# EAGLE design isolated_powerSerial_v2 (EAGLE 6.4)
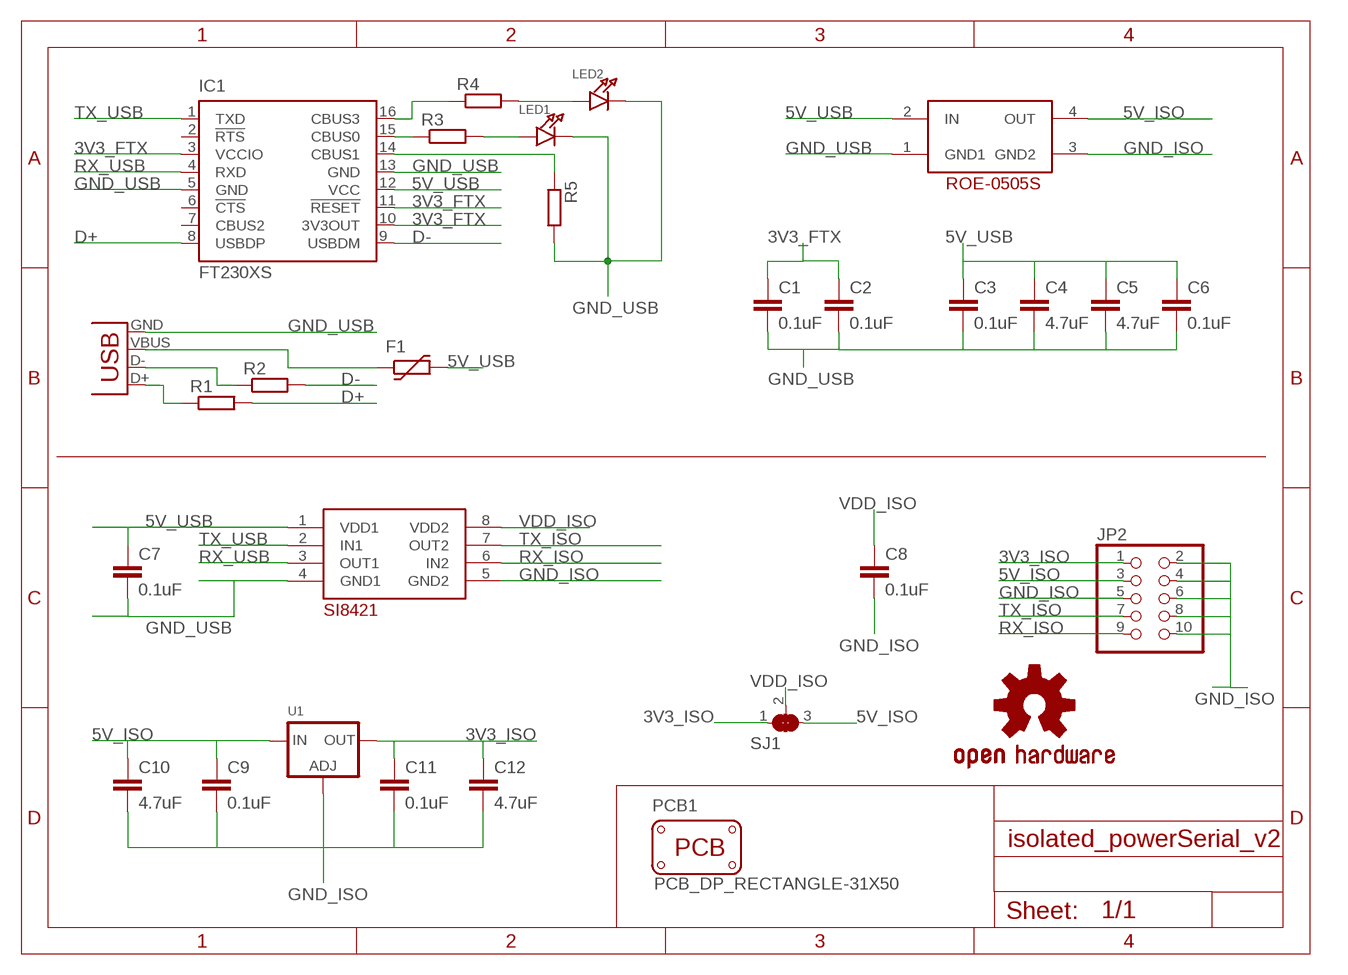
[diagram p0: schematic, sheet 1]

## Parts
C1  0.1uF  C-EUC0603  [C0603]
C2  0.1uF  C-EUC0603  [C0603]
C3  0.1uF  C-EUC0603  [C0603]
C4  4.7uF  C-EUC0603  [C0603]
C5  4.7uF  C-EUC0603  [C0603]
C6  0.1uF  C-EUC0603  [C0603]
C7  0.1uF  C-EUC0603  [C0603]
C8  0.1uF  C-EUC0603  [C0603]
C9  0.1uF  C-EUC0603  [C0603]
C10  4.7uF  C-EUC0603  [C0603]
C11  0.1uF  C-EUC0603  [C0603]
C12  4.7uF  C-EUC0603  [C0603]
F1  FUSE_PTC-0805  [PTC0805]
IC1  FT230XS  [SSOP16]
JP1  USB-SMD-NS  [USB-MINIB-NOSTOP]
JP2  PINHD-2X5  [2X05]
LED1  LED0805  [CHIPLED_0805]
LED2  LED0805  [CHIPLED_0805]
LOGO1  OSHW-LOGOS  [OSHW-LOGO-S]
PCB1  PCB_DP_RECTANGLE-31X50  [DP5031_V1]
R1  R-EU_R0603  [R0603]
R2  R-EU_R0603  [R0603]
R3  R-EU_R0603  [R0603]
R4  R-EU_R0603  [R0603]
R5  R-EU_R0603  [R0603]
SJ1  SOLDERJUMPER_2WAY0603  [SOLDERJUMPER_2WAY_OPEN_0603]
U1  LM1117SOT223-REFLOW  [SOT223-R]
U$1  IHSAN_RECOM_ROE-0505S  [IHSAN_ROE]
U$2  IHSAN_SI8421  [SO08]

## Nets
3V3_FTX: C1.1 C2.1 IC1.3(VCCIO) IC1.10(3V3OUT) IC1.11(!RESET)
3V3_ISO: C11.1 C12.1 JP2.1 SJ1.1 U1.2(OUT)
5V_ISO: C9.1 C10.1 JP2.3 SJ1.3 U1.3(IN) U$1.4(OUT)
5V_USB: C3.1 C4.1 C5.1 C6.1 C7.1 F1.2 IC1.12(VCC) U$1.2(IN) U$2.1(VDD1)
D+: IC1.8(USBDP) R1.2
D-: IC1.9(USBDM) R2.2
GND_ISO: C8.2 C9.2 C10.2 C11.2 C12.2 JP2.2 JP2.4 JP2.5 JP2.6 JP2.8 JP2.10 U1.1(ADJ) U$1.3(GND2) U$2.5(GND2)
GND_USB: C1.2 C2.2 C3.2 C4.2 C5.2 C6.2 C7.2 IC1.5(GND) IC1.13(GND) JP1.GND LED1.C LED2.C R5.2 U$1.1(GND1) U$2.4(GND1)
N$1: JP1.D- R2.1
N$2: JP1.D+ R1.1
N$3: LED1.A R3.2
N$4: LED2.A R4.2
N$5: F1.1 JP1.VBUS
N$11: IC1.14(CBUS1) R5.1
N$12: IC1.15(CBUS0) R3.1
N$13: IC1.16(CBUS3) R4.1
RX_ISO: JP2.9 U$2.6(IN2)
RX_USB: IC1.4(RXD) U$2.3(OUT1)
TX_ISO: JP2.7 U$2.7(OUT2)
TX_USB: IC1.1(TXD) U$2.2(IN1)
VDD_ISO: C8.1 SJ1.2 U$2.8(VDD2)
Unconnected: IC1.2(!RTS) IC1.6(!CTS) IC1.7(CBUS2)

## Library data of the parts
C1-C12 = rcl:C-EU: CAPACITOR, European symbol
F1 = dp_devices:FUSE_PTC: Resettable PTC
IC1 = ftdichip:FT230X: USB to BASIC UART IC Auto generated by make-symbol-device-package-bsdl.ulp Rev. 43 Source: Data sheet <http://www.ftdichip.com/Support/Documents/DataSheets/ICs/DS_FT230X.pdf>
JP1 = SparkFun-Connectors:USB: USB Connectors USB-B-PTH is fully proven SKU : PRT-00139/CONN-08278 USB-miniB is fully proven SKU : PRT-00587 USB-A-PCB is untested. USB-A-H is throughly reviewed, but untested. Spark Fun Electronics SKU : PRT-00437 USB-B-SMT is throughly reviewed, but untested. Needs silkscreen touching up. USB-A-S has not been used/tested USB-MB-H has not been used/tested USB-MICROB has been used. CONN-09505
JP2 = pinhead:PINHD-2X5: PIN HEADER
LED1 LED2 = microbuilder:LED: LED 0603 - 0603 Surface Mount Package 2mA: Green LED - Low Power (3.9mcd, 2ma, 1.7Vf) - Digikey: 475-2709-2-ND Orange LED - Low Power (9.8mcd, 2ma, 1.8Vf) - Digikey: 475-1194-2-ND Red LED - Low Power (5mcd, 2ma, 1.8Vf) - Digikey: 475-1195-2-ND Yellow LED - Low Power (7mcd, 2ma, 1.8Vf) - Digikey: 475-1196-2-ND 5mA: Blue LED - Low Power (17mcd, 5ma, 2.9Vf) - Digikey: LNJ937W8CRACT-ND 0805 - 0805 Surface Mount Package 2mA: Red LED (8.8mcd, 2mA, 1.8Vf, Clear) - Low Power [Digikey: 475-2510-1-ND] Green LED (5mcd, 2mA, 1.8Vf, Clear) - Low Power [Digikey: 475-2730-1-ND] Yellow LED (11.3mcd, 2mA, 1.8Vf, Clear) - Low Power [Digikey: 475-2555-1-ND] 20mA: Red LED (104mcd, 20mA, Diffused) - LS R976 [Digikey: 475-1278-6-ND] Red LED (12mcd, 20mA, 2.0Vf, Clear) - APT2012EC [Digikey: 754-1128-1-ND] Green LED (15mcd, 20mA, 2.2Vf, Clear) - APT2012GC [Digikey: 754-1131-1-ND] Orange LED (160mcd, 20mA, 2.1Vf, Clear) - APT2012SECK [Digikey: 754-1130-1-ND] 1206 - 1206 Surface Mount Package Green LED (26mcd, 20mA, Diffused) - LG N971 [Digikey: 475-1407-6-ND] Red LED (15mcd, 20mA, Diffused) - LH N974 [Digikey: 475-1416-6-ND]
LOGO1 = SparkFun-Aesthetics:OSHW-LOGO: Open Source Hardware Logo This logo indicates the piece of hardware it is found on incorporates a OSHW license and/or adheres to the definition of open source hardware found here: http://freedomdefined.org/OSHW
PCB1 = dp_devices:PCB_DP_RECTANGLE: Dangerous Prototypes Standard Rectangular PCB sizes
R1-R5 = rcl:R-EU_: RESISTOR, European symbol
SJ1 = microbuilder:SOLDERJUMPER_2WAY: 2-Way Solder Jumper
U1 = microbuilder:LM1117: LM1117 Voltage Regulator LM1117 Adjustable Voltage regulator [Digikey: LM1117IMP-ADJDKR-ND] LM1117 3.3V Voltage regulator [AP1117E33GDIDKR-ND] LM1117 5.0V Voltage regulator [AP1117E50GDIDKR-ND] SOT223-REFLOW - SOT223 package for solder paste/reflow ovens SOT223-WAVE - SOT223 package for hand-soldering (larger pads) Note: For the fixed-voltage regulators, simply set the ADJ pin to GND.
U$1 = SparkFun-DigitalIC_ihsan:IHSAN_RECOM_ROE-0505S
U$2 = SparkFun-DigitalIC_ihsan:IHSAN_SI8421

## Board
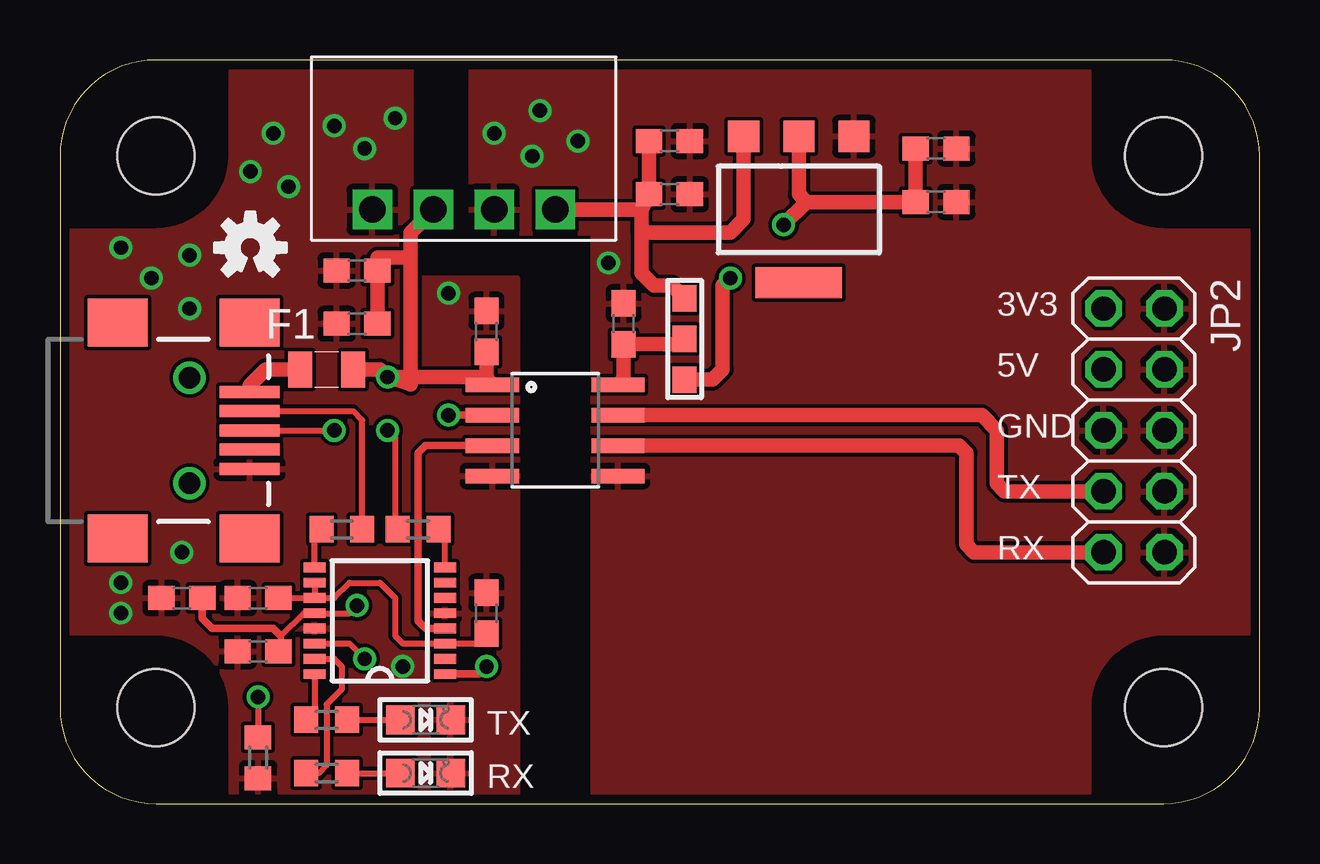
[diagram p1: board, top side]
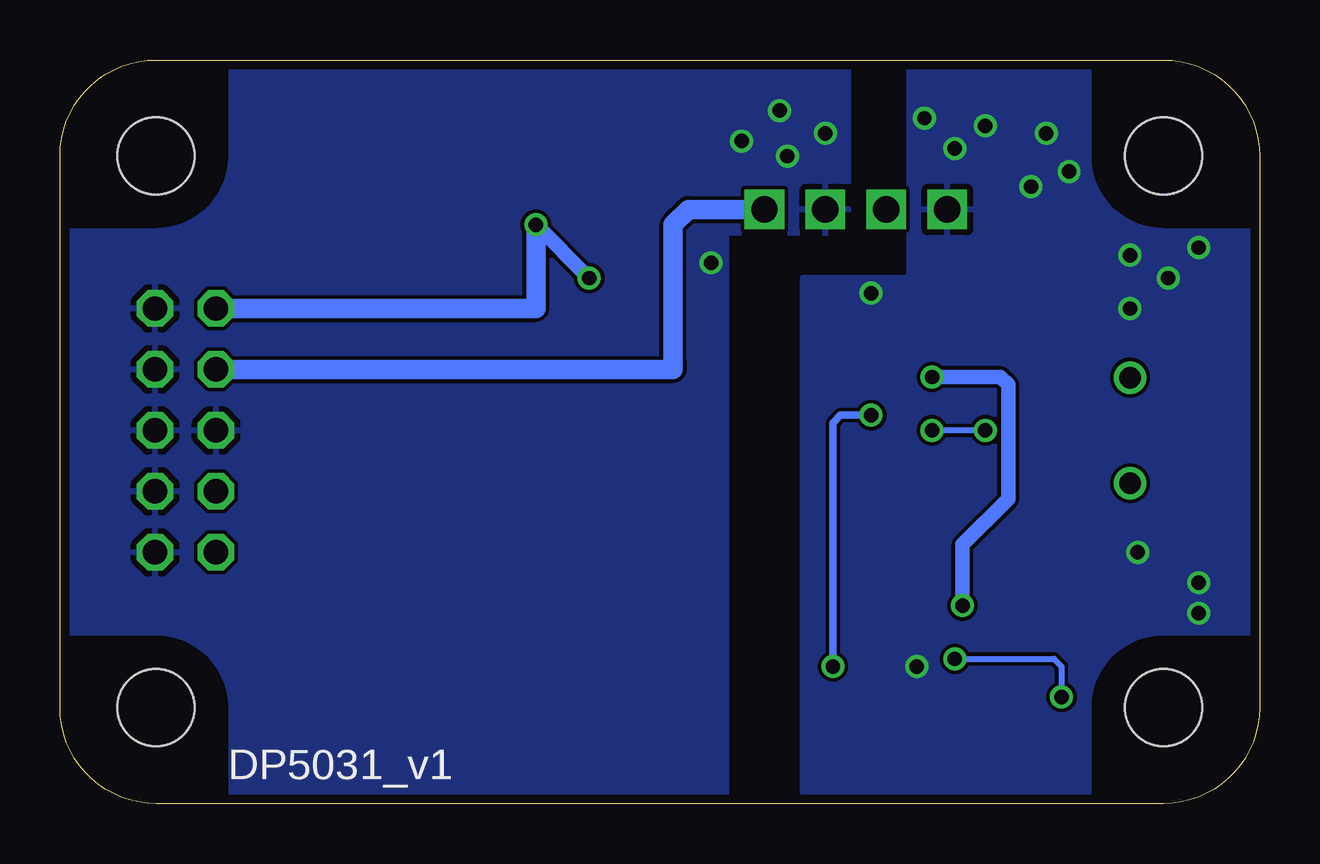
[diagram p2: board, bottom side, seen from below]

Size 50 x 31 mm. Coordinates in mm from the lower left corner, seen from the top.
Copper layers (1*16): Top 0.0356mm / dielectric 1.5011mm / Bottom 0.0356mm
Design rules "LaenPCBOrder": minimum track width 6mil, minimum drill 13mil, track to track 6mil, track to pad 6mil, pad to pad 6mil, via to via 6mil, smd to smd 6mil, copper to edge 15mil, drill to drill 6mil, minimum pad ring 7mil, minimum via ring 7mil, stop-mask expansion 4mil, vias tented up to drill 0mil, thermal gap 10mil

### Footprints (pad centres in the part's own frame; a part is rotated, then mirrored left to right if it is on the bottom)
C0603 = smd 1.1 x 1: 1 -0.85,0; 2 0.85,0
PTC0805 = smd 1 x 1.5: 1 -1.1,0; 2 1.1,0
SSOP16 = smd 0.914 x 0.406: 1 -2.718,2.223; 2 -2.718,1.587; 3 -2.718,0.953; 4 -2.718,0.318; 5 -2.718,-0.318; 6 -2.718,-0.953; 7 -2.718,-1.587; 8 -2.718,-2.223; 9 2.718,-2.223; 10 2.718,-1.587; 11 2.718,-0.953; 12 2.718,-0.318; 13 2.718,0.318; 14 2.718,0.953; 15 2.718,1.587; 16 2.718,2.223
USB-MINIB-NOSTOP = smd 2.5 x 0.5: D+ 2.5,0; D- 2.5,0.8; GND 2.5,-1.6; ID 2.5,-0.8; VBUS 2.5,1.6 | smd 2.5 x 2: G1 -3,-4.5; G2 -3,4.5; G3 2.5,4.5; G4 2.5,-4.5 | drill 0.9 pad 0.8: H1 0,2.2 | drill 0.9 pad 0.787: H2 0,-2.2
2X05 = drill 1.016 octagon: 1 -5.08,-1.27; 2 -5.08,1.27; 3 -2.54,-1.27; 4 -2.54,1.27; 5 0,-1.27; 6 0,1.27; 7 2.54,-1.27; 8 2.54,1.27; 9 5.08,-1.27; 10 5.08,1.27
CHIPLED_0805 = smd 1.2 x 1.2: A 0,-1.05; C 0,1.05
DP5031_V1 = hole 3.2: 4,4; 46,4; 46,27; 4,27
R0603 = smd 1 x 1.1: 1 -0.85,0; 2 0.85,0
SOLDERJUMPER_2WAY_OPEN_0603 = smd 1.1 x 1: 1 -1.7,0; 2 0,0; 3 1.7,0
SOT223-R = smd 1.3 x 1.3: 1 -2.3,-3.05; 2 0,-3.05; 3 2.3,-3.05 | smd 3.6 x 1.3: 4 0,3.05
IHSAN_ROE = drill 1.1 square: 1 2.54,1.27; 2 5.08,1.27; 3 7.62,1.27; 4 10.16,1.27
SO08 = smd 0.61 x 2.21: 1 -1.905,-2.616; 2 -0.635,-2.616; 3 0.635,-2.616; 4 1.905,-2.616; 5 1.905,2.616; 6 0.635,2.616; 7 -0.635,2.616; 8 -1.905,2.616

### Placement (x,y rotation side)
C1  17.78,7.94 90 top
C2  8.26,8.57 180 top
C3  17.78,19.68 90 top
C4  5.08,8.57 180 top
C5  12.38,22.23 180 top
C6  8.26,6.35 180 top
C7  12.38,20 180 top
C8  23.5,20 90 top
C9  25.4,27.62 0 top
C10  25.4,25.4 0 top
C11  36.51,27.3 0 top
C12  36.51,25.08 0 top
F1  11.11,18.1 0 top
IC1  13.34,7.62 180 top
JP1  5.4,15.56 0 top
JP2  44.77,15.56 270 top
LED1  15.24,1.27 270 top
LED2  15.24,3.49 270 top
LOGO1  7.94,23.18 0 top
PCB1  0,0 0 top
R1  14.92,11.43 0 top
R2  11.75,11.43 180 top
R3  11.11,1.27 0 top
R4  11.11,3.49 0 top
R5  8.26,1.91 270 top
SJ1  26.04,19.37 90 top
U1  30.8,24.77 180 top
U$1  10.48,23.5 0 top
U$2  20.64,15.56 270 top

### Tracks (layer width: path | path; a pad name or v marks a point on that pad's centre or on a via)
3V3_FTX
  Top 0.254: IC1.10 IC1.11 | C2.1 IC1.11 | C1.1 17.36,6.67 IC1.3 14.29,6.67 13.97,6.99 13.97,8.57 13.34,9.21 12.06,9.21 11.43,8.57 IC1.11
3V3_ISO  (via drill 0.6)
  Top 0.61: U1.2 30.8,25.4 31.11,25.08 | 31.11,25.08 C12.1 C11.1 | SJ1.1 27.19,17.67 27.62,18.1 27.62,21.59 v27.94,21.91 | v30.16,24.13 31.11,25.08
  Bottom 0.61: v27.94,21.91 v30.16,24.13
  Bottom 0.813: v30.16,24.13 30.16,21.27 30.16,20.64 JP2.1
5V_ISO
  Top 0.61: U$1.4 24.23,24.77 | 24.23,24.77 C10.1 C9.1 | 24.23,23.81 24.23,22.12 24.77,21.59 25.51,21.59 SJ1.3 | U1.3 28.5,24.37 27.94,23.81 24.23,23.81 | 24.23,23.81 24.23,24.77
  Bottom 0.813: U$1.4 23.81,24.77 24.45,24.13 24.45,18.41 24.45,18.1 JP2.3
5V_USB  (via drill 0.6)
  Top 0.254: v12.38,8.26 12.06,7.94 IC1.12 10.16,7.94 9.21,6.99 9.21,6.45 C6.1
  Top 0.305: C4.1 5.93,7.72 6.35,7.3 8.89,7.3 9.21,6.99
  Top 0.61: 12.06,18.25 F1.2 13.34,18.1 v13.65,17.78 | U$1.2 14.61,23.81 14.61,22.76 | 14.61,22.76 14.61,17.46 v13.65,17.78 | 17.68,18.73 C3.1 17.78,17.7 U$2.1 17.7,17.78 v13.65,17.78 | 14.61,22.76 13.23,22.76 C5.1 C7.1
  Bottom 0.61: v12.38,8.26 12.38,10.79 10.48,12.7 10.48,17.46 10.79,17.78 v13.65,17.78
D+
  Top 0.254: IC1.8 16.05,11.15 R1.2
D-
  Top 0.254: IC1.9 10.62,11.15 R2.2
GND_ISO  (via drill 0.6)
  other vias: 22.86,22.54 18.1,27.94 19.68,26.99 21.59,27.62 20,28.89
  pour Top: 49.85,31.11 17.14,31.11 17.14,23.81 22.23,23.81 22.23,0 49.85,0
  pour Bottom: 22.23,0 22.23,23.81 17.14,23.81 17.14,31.11 49.85,31.11 49.85,0
GND_USB  (via drill 0.6)
  other vias: 8.89,27.94 14.29,5.71 2.54,9.21 2.54,7.94 5.08,10.48 16.19,21.27 7.94,26.35 9.53,25.72 2.54,23.18 5.4,22.86 3.81,21.91 5.4,20.64 12.7,27.3 11.43,28.26 13.97,28.57
  pour Bottom: 0,0 0,31.11 14.61,31.11 14.61,21.91 19.05,21.91 19.05,0
  pour Top: 0,0 0,31.11 14.61,31.11 14.61,21.91 19.05,21.91 19.05,0
N$1
  Top 0.254: R2.1 12.6,15.98 12.22,16.36 JP1.D-
N$2  (via drill 0.6)
  Top 0.254: JP1.D+ v11.43,15.56 | v13.65,15.56 13.97,15.24 13.97,11.53 R1.1
  Bottom 0.254: v11.43,15.56 v13.65,15.56
N$3
  Top 0.254: R3.2 LED1.A
N$4
  Top 0.254: R4.2 LED2.A
N$5
  Top 0.406: JP1.VBUS 7.9,17.42
  Top 0.61: 7.9,17.42 8.57,18.1 F1.1
N$11  (via drill 0.6)
  Top 0.254: IC1.14 12.06,6.67 v12.7,6.03 | v8.26,4.45 R5.1
  Bottom 0.254: v12.7,6.03 8.57,6.03 8.26,5.71 v8.26,4.45
N$12
  Top 0.254: IC1.15 11.43,6.03 11.75,5.71 11.75,4.76 11.11,4.13 11.11,1.59 10.79,1.27 R3.1
N$13
  Top 0.254: IC1.16 10.62,3.85 R4.1
RX_ISO
  Top 0.61: U$2.6 37.47,14.92 37.78,14.61 37.78,10.79 38.1,10.48 JP2.9
RX_USB
  Top 0.305: IC1.4 15.24,7.3 14.92,7.62 14.92,14.61 15.24,14.92 U$2.3
TX_ISO
  Top 0.61: U$2.7 38.42,16.19 39.05,15.56 39.05,13.34 39.37,13.02 JP2.7
TX_USB  (via drill 0.6)
  Top 0.305: IC1.1 17.46,5.4 v17.78,5.71 | v16.19,16.19 U$2.2
  Bottom 0.305: v17.78,5.71 17.78,15.88 17.46,16.19 v16.19,16.19
VDD_ISO
  Top 0.61: U$2.8 23.5,17.7 C8.1 25.82,19.15 SJ1.2

### Text on the board
tPlace: 3V3 | 5V | GND | TX | RX | TX | RX